# EAGLE design ArticulatedPCBContactBoard (EAGLE 9.6.2)
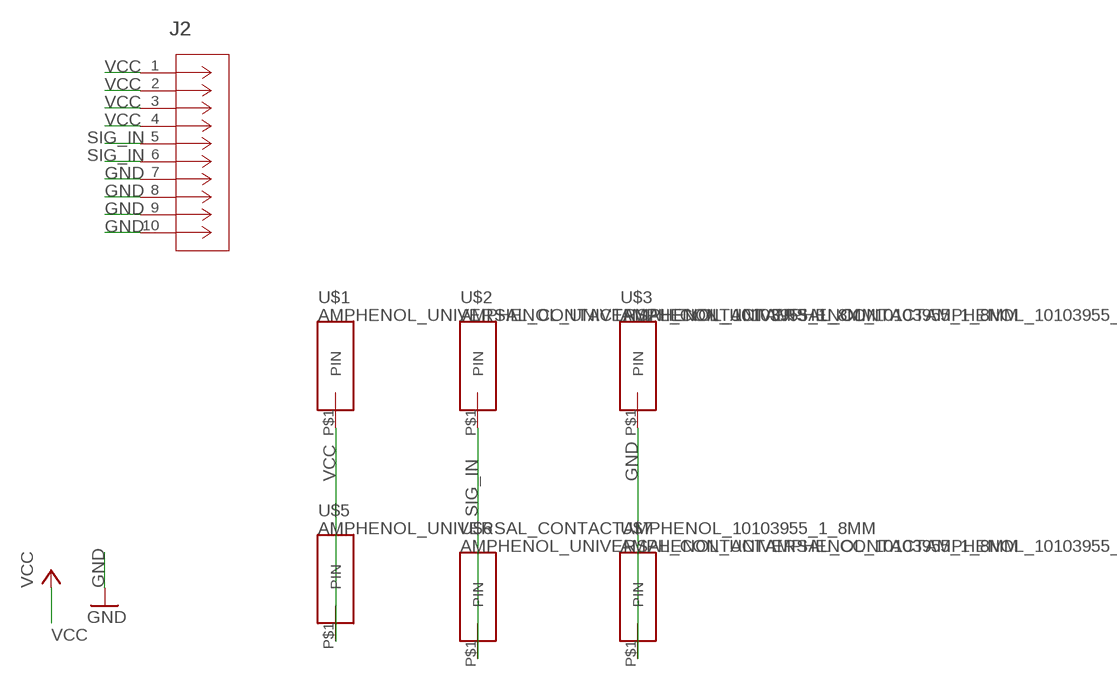
[diagram p0: schematic, sheet 1]

## Parts
J2  DF23C-10DS-0.5V(51)  [CONN_DF23C-10DS-0.5V(51)_HIR]
U$1  AMPHENOL_UNIVERSAL_CONTACTAMPHENOL_10103955_1_8MM  [AMPHENOL10103955]
U$2  AMPHENOL_UNIVERSAL_CONTACTAMPHENOL_10103955_1_8MM  [AMPHENOL10103955]
U$3  AMPHENOL_UNIVERSAL_CONTACTAMPHENOL_10103955_1_8MM  [AMPHENOL10103955]
U$5  AMPHENOL_UNIVERSAL_CONTACTAMPHENOL_10103955_1_8MM  [AMPHENOL10103955]
U$6  AMPHENOL_UNIVERSAL_CONTACTAMPHENOL_10103955_1_8MM  [AMPHENOL10103955]
U$7  AMPHENOL_UNIVERSAL_CONTACTAMPHENOL_10103955_1_8MM  [AMPHENOL10103955]

## Nets
GND: J2.7 J2.8 J2.9 J2.10 U$3.P$1(PIN) U$7.P$1(PIN)
SIG_IN: J2.5 J2.6 U$2.P$1(PIN) U$6.P$1(PIN)
VCC: J2.1 J2.2 J2.3 J2.4 U$1.P$1(PIN) U$5.P$1(PIN)

## Library data of the parts
J2 = debra:DF23C-10DS-0.5V(51); BUILT_BY: EMA_Cory; COPYRIGHT: Copyright (C) 2018 Accelerated Designs. All rights reserved; DATASHEET: https://www.hirose.com/product/document?clcode=CL0688-0306-9-51&productname=DF23C-10DS-0.5V(51)&series=DF23&documenttype=2DDrawing&lang=en&documentid=0000999034; MANUFACTURER_PART_NUMBER: DF23C-10DS-0.5V(51); SOURCELIBRARY: Add_to_database_2020-12-08; VENDOR: Hirose
U$1-U$3 U$5-U$7 = debra:AMPHENOL_UNIVERSAL_CONTACT: Universal Spring Contacts

## Board
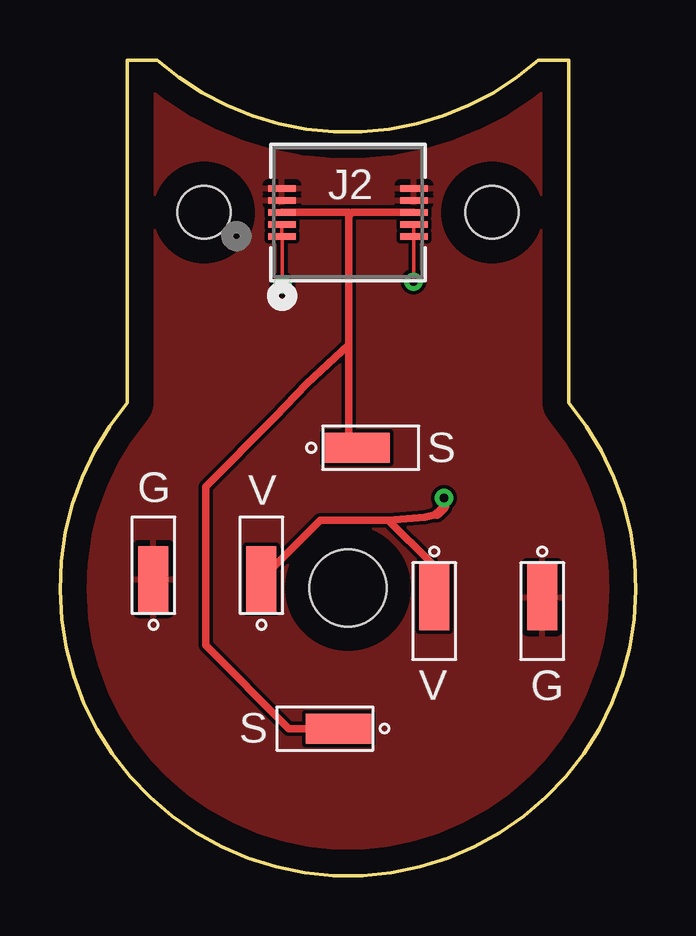
[diagram p1: board, top side]
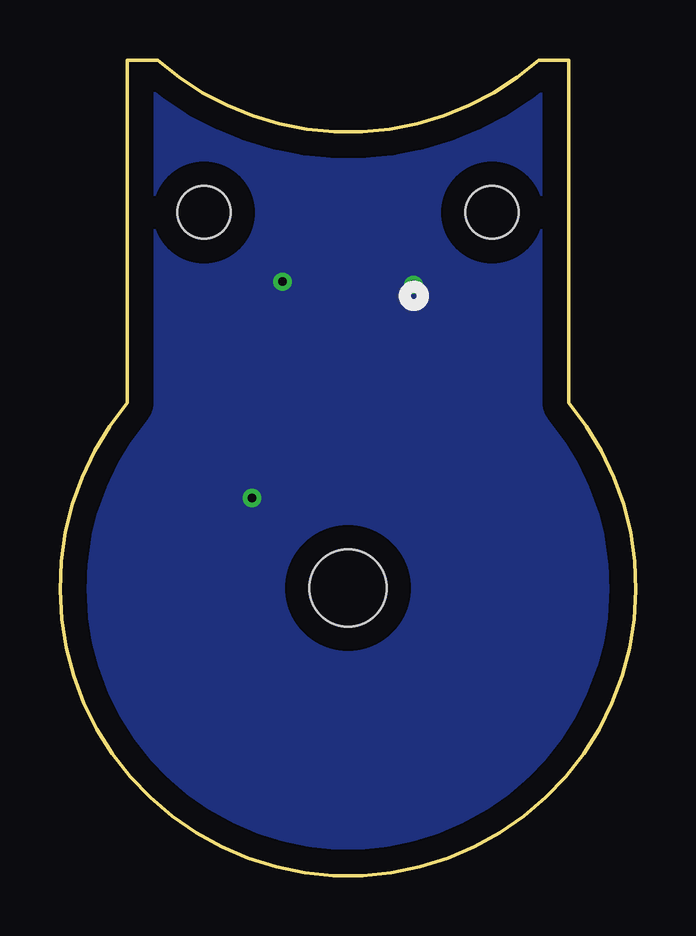
[diagram p2: board, bottom side, seen from below]

Size 24 x 33.98 mm. Coordinates in mm from the lower left corner, seen from the top.
Outline: 21.19,19.7 arc-260 2.81,19.7 2.81,33.98 4.04,33.98 arc83 19.94,33.98 21.19,33.98 21.19,19.7
Copper layers (1*16): Top 0.035mm / dielectric 1.5mm / Bottom 0.035mm
Design rules "default *": minimum track width 6mil, minimum drill 0.35mm, track to track 6mil, track to pad 6mil, pad to pad 6mil, via to via 6mil, smd to smd 6mil, copper to edge 40mil, drill to drill 6mil, minimum pad ring 10mil, minimum via ring 8mil, stop-mask expansion 4mil, vias tented up to drill 16mil, thermal gap 10mil
Holes 3.2 mm at 12,11.98
Holes 2.2 mm at 18,27.64 6,27.64

### Footprints (pad centres in the part's own frame; a part is rotated, then mirrored left to right if it is on the bottom)
CONN_DF23C-10DS-0.5V(51)_HIR = smd 0.279 x 1.143: 1 -1,2.75; 2 -1,-2.75; 3 -0.5,2.75; 4 -0.5,-2.75; 5 0,2.75; 6 0,-2.75; 7 0.5,2.75; 8 0.5,-2.75; 9 1,2.75; 10 1,-2.75
AMPHENOL10103955 = smd 1.25 x 2.75: P$1 0,0.374

### Placement (x,y rotation side)
J2  12,27.64 90 top
U$1  8.39,11.98 0 top
U$2  11.99,6.13 90 top
U$3  20.09,11.98 180 top
U$5  15.59,11.98 180 top
U$6  11.99,17.83 270 top
U$7  3.89,11.98 0 top

### Tracks (layer width: path | path; a pad name or v marks a point on that pad's centre or on a via)
GND
  pour Top: -0.25,-0.52 -0.25,36.86 27.68,36.86 27.68,-0.52
SIG_IN
  Top 0.305: U$2.P$1 9.54,6.13 6.06,9.6 6.06,16.21 8.95,19.1 10.29,20.49 12.03,22.11 | 12.03,27.48 12.03,27.64 J2.5 | 12.03,27.48 12.03,22.11 | U$6.P$1 12.03,18.16 12.03,22.11 | 12.03,27.48 12.18,27.64 J2.6
VCC  (via drill 0.35)
  Top 0.152: J2.3 J2.1 9.27,26.61 v9.27,24.62 | J2.4 J2.2 14.75,24.77 v14.73,24.75
  Top 0.305: U$1.P$1 10.85,14.81 13.68,14.81 | U$5.P$1 15.46,11.73 15.46,13.03 13.68,14.81 | 15.72,15.07 15.21,14.94 13.68,14.81
  Top 0.406: v16,15.73 16,15.35 15.72,15.07
  pour Bottom: -0.25,-0.52 -0.25,36.93 27.81,36.93 27.81,-0.52

### Text on the board
tPlace: S | G | V | V | G | S